# Altium schematic sheet DC.SchDoc: param:Title (part 3 of 3)
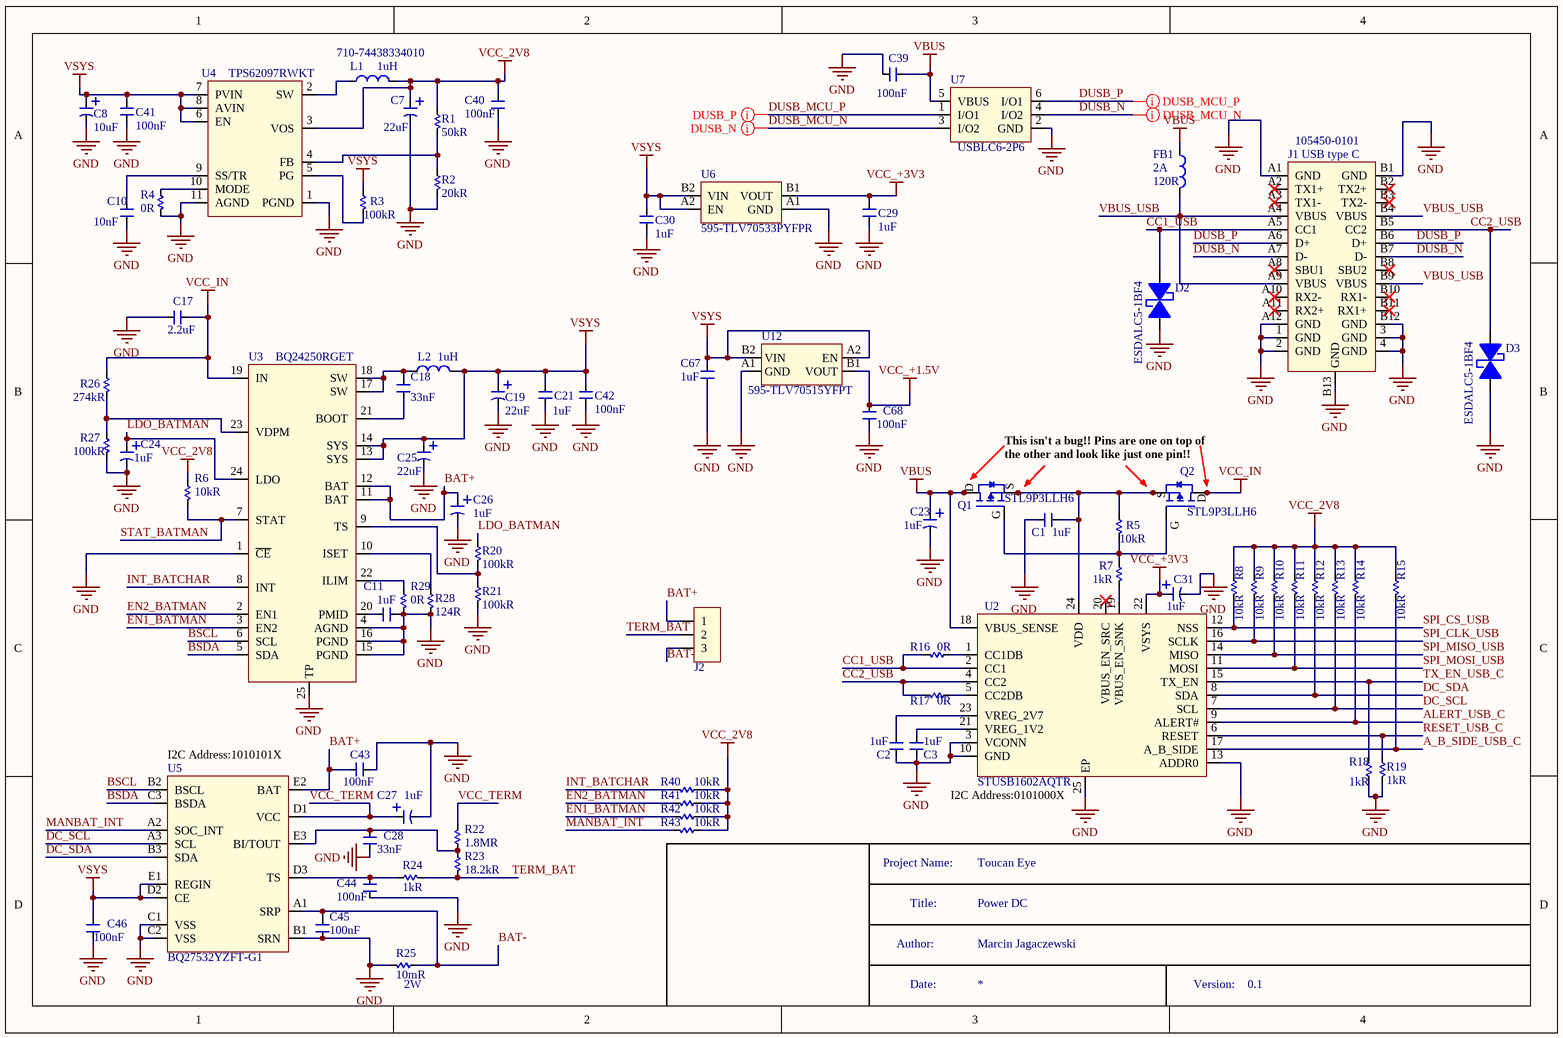
[diagram p2: DC.SchDoc]

## Library data of the parts (continued)
U7 = USBLC6-2P6: TVS DIODE 5.25VWM 17VC SOT666; Manufacturer: STMicroelectronics; Direction: Unidirectional,Bidirectional; Clamping Voltage: 17V; Capacitance: 3.5pF; Number of Bidirectional Channels: 2; Reverse Standoff Voltage: 5V; Min Breakdown Voltage: 6V; Power Line Protection: Yes; Leakage Current: 150nA; Peak Pulse Current: 5A; Test Current: 1mA; Number of Elements: 1; Element Configuration: Dual; Supplier 1: Mouser; Stock 1: 6872; Pricing 1: 1=0.49, 10=0.405, 50=0.405, 100=0.247, 1000=0.191, 10000=0.152 (USD); Mount: Surface Mount; Case/Package: SOT-666; Number of Pins: 6; Contact Plating: Tin,Matte; Min Operating Temperature: -40°C; Max Operating Temperature: 125°C; Packaging: Tape and Reel; Package Quantity: 1; Breakdown Voltage: 6V; Operating Supply Voltage: 5V; Number of Channels: 2; Polarity: Unidirectional,Bidirectional; Termination: SMD/SMT; Working Voltage: 5V; ESD Protection: Yes; Max Reverse Leakage Current: 150nA; Reverse Breakdown Voltage: 6V; Max Breakdown Voltage: 6V; Length: 1.7mm; Height: 0.6mm; Depth: 1.3mm; Width: 1.3mm; Radiation Hardening: No; Lead Free: Lead Free; REACH SVHC: No SVHC; ComponentLink1URL: https://datasheet.ciiva.com/15143/getdatasheetpartid-98673-15143462.pdf; ComponentLink1Description: https://datasheet.ciiva.com/15143/getdatasheetpartid-98673-15143462.pdf; ComponentLink2URL: https://datasheet.ciiva.com/14186/usblc6-2-st-eng-tds-14186568.pdf; ComponentLink2Description: https://datasheet.ciiva.com/14186/usblc6-2-st-eng-tds-14186568.pdf; ComponentLink3URL: https://datasheet.ciiva.com/16378/cd00050750-16378714.pdf; ComponentLink3Description: https://datasheet.ciiva.com/16378/cd00050750-16378714.pdf; ComponentLink4URL: https://datasheet.ciiva.com/4508/cd00050750-4508892.pdf; ComponentLink4Description: https://datasheet.ciiva.com/4508/cd00050750-4508892.pdf; ComponentLink5URL: https://datasheet.ciiva.com/22685/1690354-22685832.pdf; ComponentLink5Description: https://datasheet.ciiva.com/22685/1690354-22685832.pdf; ComponentLink6URL: https://datasheet.ciiva.com/22692/1690354-22692453.pdf; ComponentLink6Description: https://datasheet.ciiva.com/22692/1690354-22692453.pdf; ComponentLink7URL: https://datasheet.ciiva.com/41444/001184108-da-01-en-ic-esd-protection-usblc6-2p6-sot-666-stm-41444134.pdf; ComponentLink7Description: https://datasheet.ciiva.com/41444/001184108-da-01-en-ic-esd-protection-usblc6-2p6-sot-666-stm-41444134.pdf; Supplier Part Number 1: 511-USBLC6-2P6; *SCHChecked: 1; *PCBChecked: 1; Manufacturer Part Number: USBLC6-2P6
U12 = TLV70515YFPT: LDO Voltage Regulators 200mA Lo IQ Lo-Noise LDO Reg; Manufacturer: Texas Instruments; Max Power Dissipation: 714mW; Max Input Voltage: 6V; Output Voltage: 1.5V; Dropout Voltage: 250mV; Min Input Voltage: 2V; Number of Regulators: 1; Min Current Limit: 260mA; Power Supply Rejection Ratio (PSRR): 80dB; Quiescent Current: 30uA; Supplier 1: Mouser; Manufacturer Part Number: TLV70515YFPT; Stock 1: 250; Pricing 1: 1=0.62, 10=0.513, 50=0.513, 100=0.313, 1000=0.242, 10000=0.192 (USD); Mount: Surface Mount; Number of Pins: 4; Min Operating Temperature: -40°C; Max Operating Temperature: 125°C; Packaging: Tape and Reel; Package Quantity: 250; Output Current: 200mA; Number of Outputs: 1; Lead Free: Lead Free; ComponentLink1URL: http://www.ti.com/lit/gpn/tlv705; ComponentLink1Description: http://www.ti.com/lit/gpn/tlv705; ComponentLink2URL: http://www.ti.com/lit/ds/symlink/tlv705.pdf; ComponentLink2Description: http://www.ti.com/lit/ds/symlink/tlv705.pdf; *SCHChecked: 1; *PCBChecked: 1